# Altium schematic sheet Group14StepperMotorDriver.SchDoc
size A; SheetNumber: 2; SheetTotal: 2
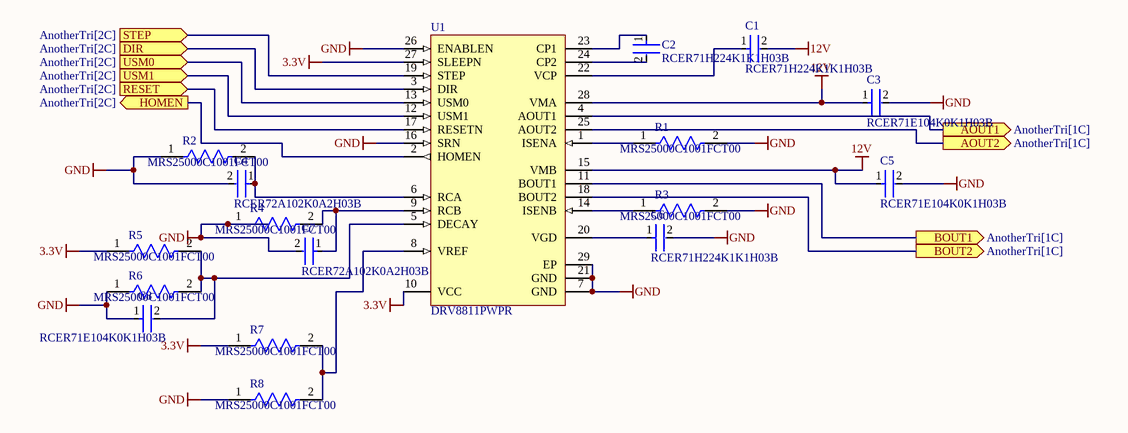
[diagram p0: Group14StepperMotorDriver.SchDoc]

## Parts
C1  RCER71H224K1K1H03B  [FP-RCE1K1-2_5-MFG]
C2  RCER71H224K1K1H03B  [FP-RCE1K1-2_5-MFG]
C3  RCER71E104K0K1H03B  [FP-RCE0K1-MFG]
C4  RCER72A102K0A2H03B  [FP-RCE0DB-MFG]
C5  RCER71E104K0K1H03B  [FP-RCE0K1-MFG]
C6  RCER71H224K1K1H03B  [FP-RCE1K1-2_5-MFG]
C7  RCER72A102K0A2H03B  [FP-RCE0DB-MFG]
C8  RCER71E104K0K1H03B  [FP-RCE0K1-MFG]
R1  MRS25000C1001FCT00  [FP-MRS25-MFG]
R2  MRS25000C1001FCT00  [FP-MRS25-MFG]
R3  MRS25000C1001FCT00  [FP-MRS25-MFG]
R4  MRS25000C1001FCT00  [FP-MRS25-MFG]
R5  MRS25000C1001FCT00  [FP-MRS25-MFG]
R6  MRS25000C1001FCT00  [FP-MRS25-MFG]
R7  MRS25000C1001FCT00  [FP-MRS25-MFG]
R8  MRS25000C1001FCT00  [FP-MRS25-MFG]
U1  DRV8811PWPR  [PWP0028C_L]

## Ports
AOUT1 (out, see AnotherTri[1C]), AOUT2 (out, see AnotherTri[1C]), BOUT1 (out, see AnotherTri[1C]), BOUT2 (out, see AnotherTri[1C]), DIR (in, see AnotherTri[2C]), HOMEN (out, see AnotherTri[2C]), RESET (in, see AnotherTri[2C]), STEP (in, see AnotherTri[2C]), USM0 (in, see AnotherTri[2C]), USM1 (in, see AnotherTri[2C])

## Nets
3.3V: R5.1 R7.1 U1.10(VCC) U1.27(SLEEPN)
12V: C1.2 C3.1 C5.1 U1.15(VMB) U1.28(VMA)
GND: C3.2 C4.2 C5.2 C6.2 C7.2 C8.1 R1.2 R2.1 R3.2 R4.1 R6.1 R8.1 U1.7(GND) U1.16(SRN) U1.21(GND) U1.26(ENABLEN) U1.29(EP)
AOUT1: U1.4(AOUT1) ; port AOUT1
AOUT2: U1.25(AOUT2) ; port AOUT2
BOUT1: U1.11(BOUT1) ; port BOUT1
BOUT2: U1.18(BOUT2) ; port BOUT2
DIR: U1.3(DIR) ; port DIR
HOMEN: U1.2(HOMEN) ; port HOMEN
RESET: U1.17(RESETN) ; port RESET
STEP: U1.19(STEP) ; port STEP
USM0: U1.13(USM0) ; port USM0
USM1: U1.12(USM1) ; port USM1
NetC1_1: C1.1 U1.22(VCP)
NetC2_1: C2.1 U1.23(CP1)
NetC2_2: C2.2 U1.24(CP2)
NetC4_1: C4.1 R2.2 U1.6(RCA)
NetC6_1: C6.1 U1.20(VGD)
NetC7_1: C7.1 R4.2 U1.9(RCB)
NetC8_2: C8.2 R5.2 R6.2 U1.5(DECAY)
NetR1_1: R1.1 U1.1(ISENA)
NetR3_1: R3.1 U1.14(ISENB)
NetR7_2: R7.2 R8.2 U1.8(VREF)

## Library data of the parts
C1 C2 C6 = CMP-06035-033138-1: Cap Ceramic Monolithic 220nF 50V 10% Thru-Hole Bulk; Lead Diameter: 0.5mm; Lead/Base Style: Formed Leads; Dielectric: X7R; Ratings: AEC-Q200; Min Operating Temperature: -55°C; Resistor Type: Ceramic; Height - Seated (Max): 0.138inch; Voltage Rating (DC): 50V; Termination: Radial; Max Operating Temperature: 125°C; Tolerance: 10%; Lead Pitch: 0.197inch; Case/Package: Radial; Capacitance: 220nF; Mount: Through Hole; Height: 3.5mm; Packaging: Bulk; Voltage Rating: 50V; Length: 0.157inch; Width: 0.098inch; Package Quantity: 500
C3 C5 C8 = CMP-06035-038410-1: Cap Ceramic 100nF 25V X7R ±10% Radial 5mm +125°C Automotive Bulk
C4 C7 = CMP-06035-055415-1: Cap Ceramic 1nF 100V X7R ±10% Radial 2.5mm +125°C Bulk; Lead Diameter: 0.5mm; Lead/Base Style: Straight; Length: 0.142inch; Package Quantity: 500; Packaging: Bulk; Max Operating Temperature: 125°C; Ratings: AEC-Q200; Dielectric: X7R; Tolerance: 10%; Height: 3.5mm; Min Operating Temperature: -55°C; Height - Seated (Max): 0.138inch; Case/Package: Radial; Voltage Rating: 100V; Voltage Rating (DC): 100V; Lead Pitch: 0.098inch; Mount: Through Hole; Resistor Type: Ceramic; Capacitance: 1nF; Termination: Radial; Width: 0.098inch
R1-R8 = CMP-02408-000051-1: RES 1K OHM 0.6W 1% AXIAL; Power Rating: 600mW; Lead Diameter: 0.6mm; Voltage Rating (DC): 350V; Resistance: 1kR; Temperature Coefficient: 50ppm/°C; Width: 2.5mm; Military Standard: Not; Package Quantity: 5000; Radiation Hardening: No; Case/Package: Axial; Resistance Tolerance: 1%; Resistor Type: Metal Film; Contact Plating: Tin; Length: 6.5mm; Lead Free: Lead Free; RoHS Compliant: Yes; Mount: Through Hole; Number of Pins: 2; Technology: THIN FILM; Voltage Rating: 350V; Min Operating Temperature: -55°C; Weight: 0.00776oz; Diameter: 2.5mm; Construction: Cylindrical; Series: MRS25; Tolerance: 1%; Packaging: Tape and Reel; Max Operating Temperature: 155°C; Max Power Dissipation: 600mW; Number of Terminations: 2; Termination: Axial
U1 = CMP-1556-00003-2: 1.9 A Bipolar Stepper Motor Driver with On-Chip 1 / 8 Microstepping Indexer (Step / Dir Ctrl), -40 to 85 degC, 28-pin HTSSOP (PWP), Green (RoHS & no Sb/Br); Peak Output Current(A): 1.9; Thermal Shutdown: TRUE; PartNumber: DRV8811PWPR; Package Reference: PWP0028C; PackageDescription: 28-Pin Plastic Small Outline, Body 9.70 x 4.40 mm, Pitch 0.65 mm; Code_JEDEC: MO-153; ComponentLink1Description: Manufacturer URL; PackageVersion: 4073225-6/I, 05/2011; ComponentLink3Description: Package Specification; ComponentLink1URL: http://www.ti.com/; ComponentLink2Description: Datasheet; DatasheetVersion: SLVS865G; Eco-Plan: Green (RoHS & no Sb/Br); ComponentLink3URL: http://www.ti.com/litv/pdf/mpds373; Mounting Technology: Surface Mount; ComponentLink2URL: http://www.ti.com/general/docs/lit/getliterature.tsp?genericPartNumber=DRV8811&fileType=pdf